# Altium schematic sheet deel1_voeding.SchDoc
size A4; SheetNumber: 1; SheetTotal: 5
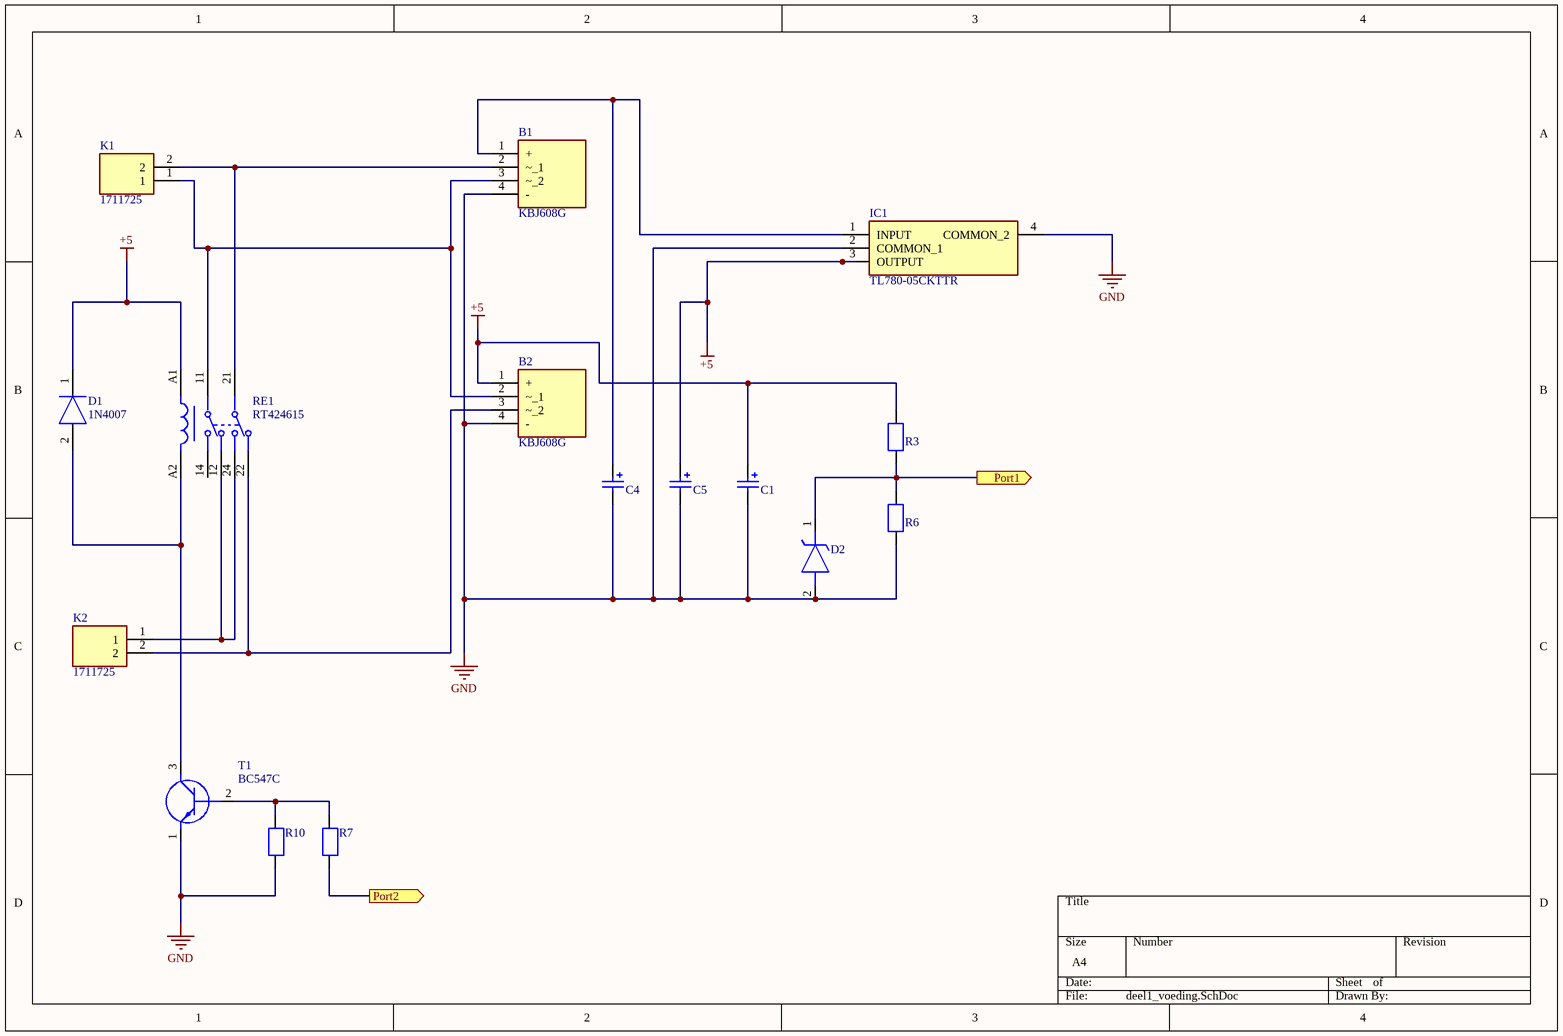
[diagram p0: deel1_voeding.SchDoc]

## Parts
B1  KBJ608G  [TO750P480X2500X1900-4P]
B2  KBJ608G  [TO750P480X2500X1900-4P]
C1  4700uF  [WCAP-ATG8_D22H41]  (value not drawn)
C4  100uF  [WCAP-ATG8_D8H11.5]  (value not drawn)
C5  10uF  [WCAP-ATG8_D5H11]  (value not drawn)
D1  1N4007  [DIOM5327X242N]
D2  1N4106  [DIOAD1256W51L444D203]  (value not drawn)
IC1  TL780-05CKTTR  [TL78005CKTTR]
K1  1711725  [1711725]
K2  1711725  [1711725]
R3  CRCW08050000Z0EA  [RESC2013X50X30LL20T20]  (value not drawn)
R6  CRCW08050000Z0EA  [RESC2013X50X30LL20T20]  (value not drawn)
R7  CRCW08050000Z0EA  [RESC2013X50X30LL20T20]  (value not drawn)
R10  CRCW08050000Z0EA  [RESC2013X50X30LL20T20]  (value not drawn)
RE1  RT424615  [FP-RT424615-MFG]
T1  BC547C  [BC547C]

## Ports
Port1 (out), Port2 (out)

## Nets
+5: B2.1(+) C1.1(P) C5.1(P) D1.1(K) IC1.3(OUTPUT) R3.2 RE1.A1
GND: B1.4(-) B2.4(-) C1.2(N) C4.2(N) C5.2(N) D2.2(A) IC1.2(COMMON_1) IC1.4(COMMON_2) R6.1 R10.1 T1.1(E)
Port1: D2.1(K) R3.1 R6.2 ; port Port1
Port2: R7.1 ; port Port2
NetB1_1: B1.1(+) C4.1(P) IC1.1(INPUT)
NetB1_2: B1.2(~_1) K1.2 RE1.21
NetB1_3: B1.3(~_2) B2.2(~_1) K1.1 RE1.11
NetB2_3: B2.3(~_2) K2.2 RE1.22
NetD1_2: D1.2(A) RE1.A2 T1.3(C)
NetK2_1: K2.1 RE1.12 RE1.24
NetR7_2: R7.2 R10.2 T1.2(B)

Not connected (* = marked no-connect by the designer): RE1 14

## Library data of the parts
B1 B2 = KBJ608G: Bridge Rectifier; Manufacturer_Name: Diodes Inc.; Datasheet Link: https://www.diodes.com/assets/Datasheets/ds21207.pdf; Height: 4.8mm; Manufacturer_Part_Number: KBJ608G; Mouser Part Number: 621-KBJ608G; Mouser Price/Stock: https://www.mouser.co.uk/ProductDetail/Diodes-Incorporated/KBJ608G?qs=zpnZCIghiEzyVG1EfRzSrg%3D%3D; Arrow Part Number: KBJ608G; Arrow Price/Stock: https://www.arrow.com/en/products/kbj608g/diodes-incorporated
C1 = 860010683032: WCAP-ATG8 Aluminum Electrolytic Capacitor, Radial THT, D22xH41mm, 4700uF, 50V; Manufacturer: Wurth Elektronik; Capacitance Tolerance: +/-20%; Dissipation Factor: 10%; Endurance: 2000h; Leakage Current: 2350uA; Ripple Current: 3355mA; Technical Reference: ATBN410472M050DSPS2B000; ComponentLink1Description: Manufacturer Link; ComponentLink1URL: https://www.we-online.com/redexpert/article/860010683032?ad; ComponentLink2Description: Datasheet; ComponentLink2URL: https://www.we-online.com/redexpert/spec/860010683032?ad; Category: Aluminum Electrolytic Capacitors; Match Code: WCAP-ATG8; Manufacturer Part Number: 860010683032; Mount: Through Hole; Operating Temperature Max: 85°C; Operating Temperature Min: -40°C; Packaging: Ammo Pack; Height: 41mm; Diameter: 22mm; Capacitance: 4700uF; Rated Voltage (DC): 50V
C4 = 860010674014: WCAP-ATG8 Aluminum Electrolytic Capacitor, Radial THT, D8xH11.5mm, 100uF, 50V; Manufacturer: Wurth Elektronik; Capacitance Tolerance: +/-20%; Dissipation Factor: 10%; Endurance: 2000h; Leakage Current: 50uA; Ripple Current: 286mA; Technical Reference: ATBE115101M050DSPA7B000; ComponentLink1Description: Manufacturer Link; ComponentLink1URL: https://www.we-online.com/redexpert/article/860010674014?ad; ComponentLink2Description: Datasheet; ComponentLink2URL: https://www.we-online.com/redexpert/spec/860010674014?ad; Category: Aluminum Electrolytic Capacitors; Match Code: WCAP-ATG8; Manufacturer Part Number: 860010674014; Mount: Through Hole; Operating Temperature Max: 85°C; Operating Temperature Min: -40°C; Packaging: Ammo Pack; Height: 11.5mm; Diameter: 8mm; Capacitance: 100uF; Rated Voltage (DC): 50V
C5 = 860010672009: WCAP-ATG8 Aluminum Electrolytic Capacitor, Radial THT, D5xH11mm, 10uF, 50V; Manufacturer: Wurth Elektronik; Capacitance Tolerance: +/-20%; Dissipation Factor: 10%; Endurance: 2000h; Leakage Current: 5uA; Ripple Current: 72mA; Technical Reference: ATBC110100M050DSPA3B000; ComponentLink1Description: Manufacturer Link; ComponentLink1URL: https://www.we-online.com/redexpert/article/860010672009?ad; ComponentLink2Description: Datasheet; ComponentLink2URL: https://www.we-online.com/redexpert/spec/860010672009?ad; Category: Aluminum Electrolytic Capacitors; Match Code: WCAP-ATG8; Manufacturer Part Number: 860010672009; Mount: Through Hole; Operating Temperature Max: 85°C; Operating Temperature Min: -40°C; Packaging: Ammo Pack; Height: 11mm; Diameter: 5mm; Capacitance: 10uF; Rated Voltage (DC): 50V
D1 = 1N4007: Diode; Manufacturer_Name: Shikues; Datasheet Link: https://datasheet.lcsc.com/szlcsc/SK-1N4007_C126233.pdf; Height: 2.42mm; Manufacturer_Part_Number: 1N4007
D2 = 1N4106: Zener Diode; Manufacturer_Name: Aeroflex; Manufacturer_Part_Number: 1N4106; Mouser Part Number: 494-1N4106; Mouser Price/Stock: https://www.mouser.co.uk/ProductDetail/Microchip-Technology/1N4106?qs=oomPkbqnLXdGSIETmNyTug%3D%3D; Arrow Part Number: 1N4106; Arrow Price/Stock: https://www.arrow.com/en/products/1n4106/microchip-technology?region=nac
IC1 = TL780-05CKTTR: Integrated Circuit; Manufacturer_Name: Texas Instruments; Datasheet Link: http://www.ti.com/general/docs/suppproductinfo.tsp?distId=26&gotoUrl=http%3A%2F%2Fwww.ti.com%2Flit%2Fgpn%2Ftl780; Height: 5.08mm; Manufacturer_Part_Number: TL780-05CKTTR; Mouser Part Number: 595-TL780-05CKTTR; Mouser Price/Stock: https://www.mouser.co.uk/ProductDetail/Texas-Instruments/TL780-05CKTTR?qs=7kv20MEVUlhtPP21hgiOlA%3D%3D; Arrow Part Number: TL780-05CKTTR; Arrow Price/Stock: https://www.arrow.com/en/products/tl780-05ckttr/texas-instruments?region=nac
K1 K2 = 1711725: Connector; Manufacturer_Name: Phoenix Contact; Datasheet Link: http://www.phoenixcontact.com/de/produkte/1711725/pdf; Height: 18.2mm; Manufacturer_Part_Number: 1711725; Mouser Part Number: 651-1711725; Mouser Price/Stock: https://www.mouser.co.uk/ProductDetail/Phoenix-Contact/1711725?qs=F79NelsxgYFLEb9U5DotcA%3D%3D; Arrow Part Number: 1711725; Arrow Price/Stock: https://www.arrow.com/en/products/1711725/phoenix-contact?region=nac
R3 R6 = resistor: Manufacturer: Vishay Dale; Part Number: CRCW08050000Z0EA
R7 = resistor: 10k; Manufacturer: Vishay Dale; Part Number: CRCW08050000Z0EA
R10 = resistor: 4k7; Manufacturer: Vishay Dale; Part Number: CRCW08050000Z0EA
RE1 = CMP-03395-000241-1: RELAY GEN PURPOSE DPDT 8A 115V; Max Current Rating: 15A; Ratings: IP54; Coil Type: Non-Latching; Power Rating: 760mW; Max Voltage Rating (AC): 400V; Coil Resistance: 8.1kR; Operate Time: 8ms; Approvals: CSA; Application(s): POWER; Relay Type: General Purpose; Switching Capacity: 2kW; Length: 29mm; Switching Current: 8A; Mount: Through Hole; Contact Current Rating: 8A; Coil Voltage (AC): 115V; Voltage Rating (AC): 400V; Width: 12.7mm; Radiation Hardening: No; Case/Package: DIP; Current Rating: 8A; Number of Pins: 8; Height: 15.7mm; Series: RT2, SCHRACK; Throw Configuration: DPDT; Packaging: Rail/Tube; Package Quantity: 500; Min Operating Temperature: -40°C; Termination: PC Pin; RoHS Compliant: Yes; Depth: 12.7mm; Max Operating Temperature: 70°C; Contact Material: Silver
T1 = BC547C: Transistor BJT NPN; Manufacturer_Name: NXP; Datasheet Link: https://datasheet.octopart.com/BC547C-Philips-datasheet-120064.pdf; Height: 5.2mm; Manufacturer_Part_Number: BC547C; Mouser Part Number: 771-BC547C; Mouser Price/Stock: https://www.mouser.co.uk/ProductDetail/NXP-Semiconductors/BC547C/?qs=84A%2FDAdkstKO21mOGqKGFw%3D%3D